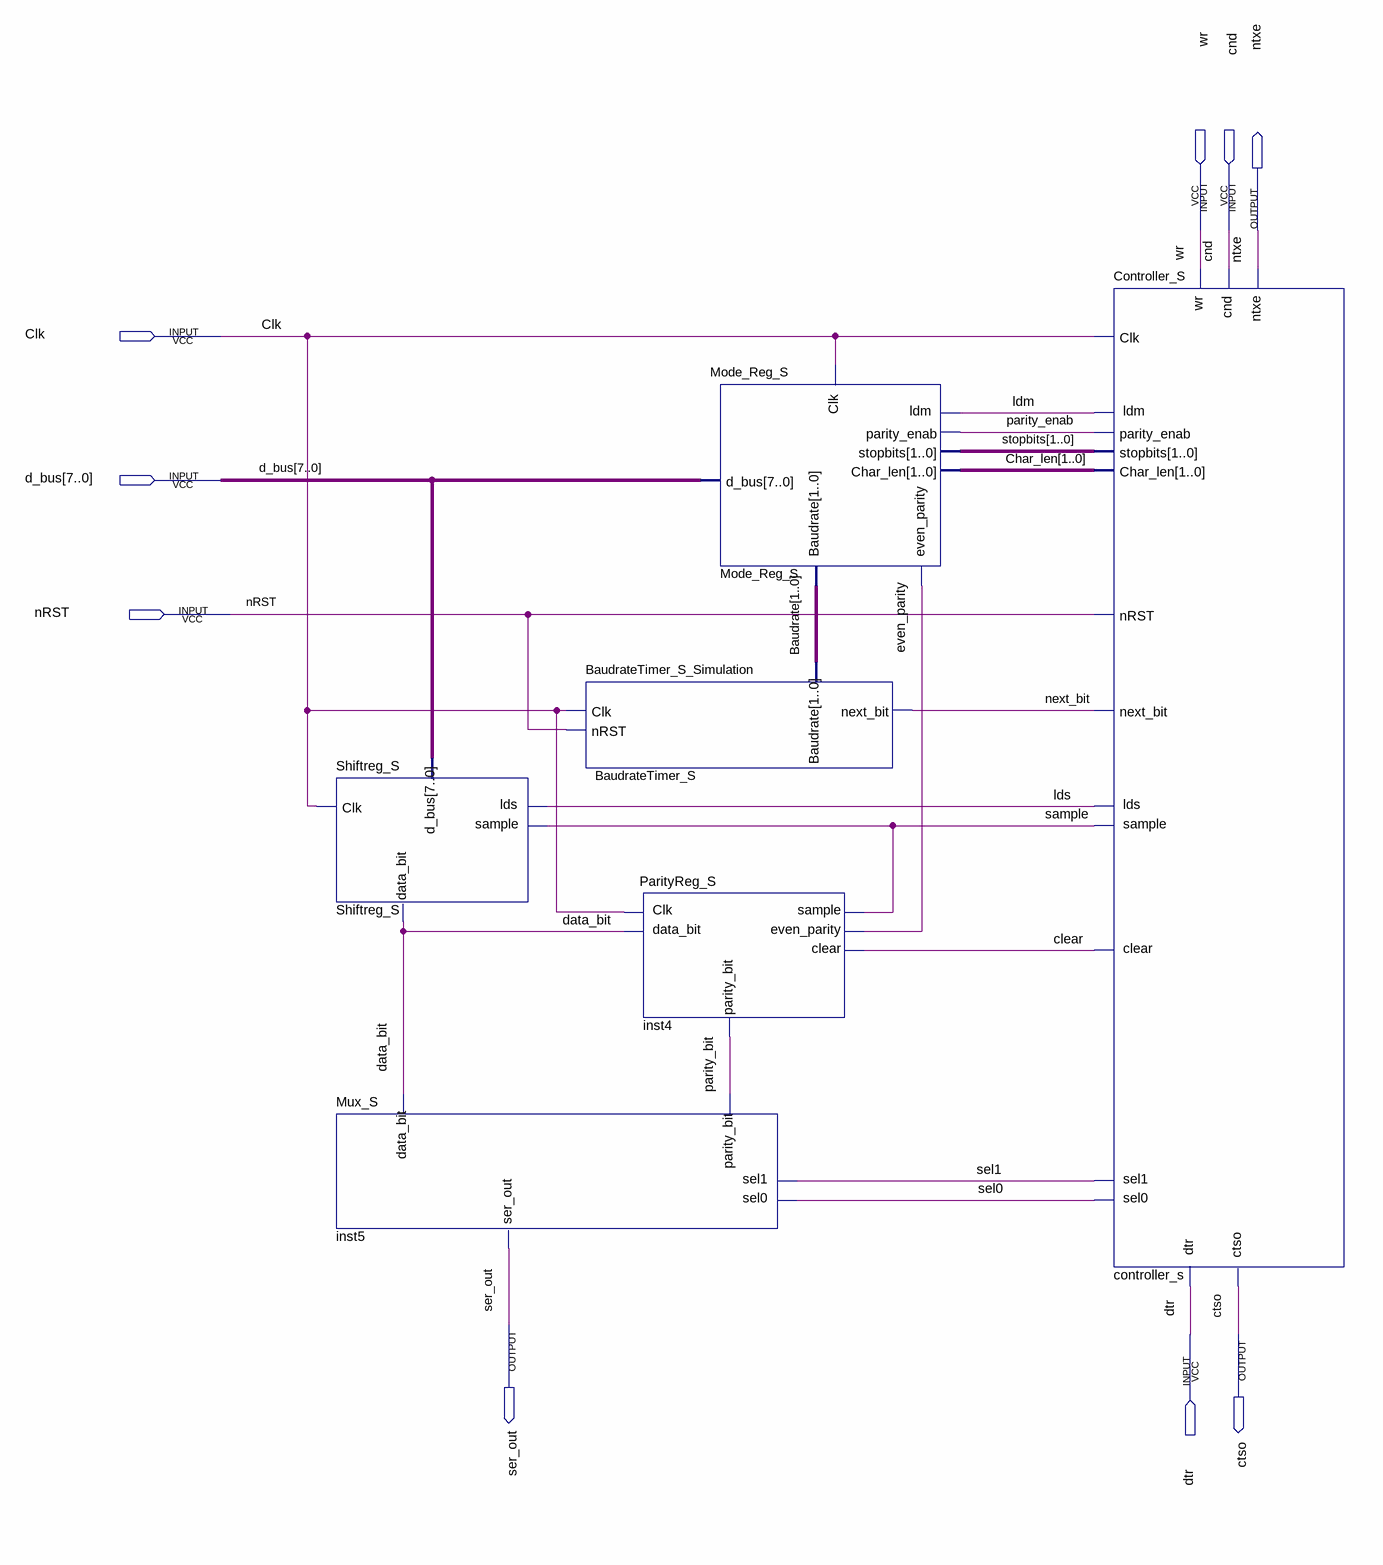
[diagram p0: schematic sheet]
// Quartus schematic Par2Ser_Simulation.bdf as structural Verilog: 6 symbols, 9 pins
module Par2Ser_Simulation (
  input  wr,
  input  cnd,
  input  Clk,
  input  [7:0] d_bus,
  input  nRST,
  input  dtr,
  output ntxe,
  output ser_out,
  output ctso
);

  wire clear, data_bit, even_parity, ldm, lds, next_bit, parity_bit, parity_enab, sample, sel0, sel1;
  wire [1:0] Baudrate, Char_len, stopbits;

  Shiftreg_S Shiftreg_S (.Clk(Clk), .d_bus(d_bus), .lds(lds), .sample(sample), .data_bit(data_bit));
  Mux_S inst5 (.data_bit(data_bit), .parity_bit(parity_bit), .sel0(sel0), .sel1(sel1), .ser_out(ser_out));
  BaudrateTimer_S_Simulation BaudrateTimer_S (.Baudrate(Baudrate), .Clk(Clk), .nRST(nRST), .next_bit(next_bit));
  ParityReg_S inst4 (
    .Clk(Clk), .clear(clear), .data_bit(data_bit), .even_parity(even_parity), .sample(sample),
    .parity_bit(parity_bit));
  Mode_Reg_S Mode_Reg_S (
    .Clk(Clk), .d_bus(d_bus), .ldm(ldm), .Baudrate(Baudrate), .Char_len(Char_len), .even_parity(even_parity),
    .parity_enab(parity_enab), .stopbits(stopbits));
  Controller_S controller_s (
    .Char_len(Char_len), .Clk(Clk), .cnd(cnd), .dtr(dtr), .nRST(nRST), .next_bit(next_bit),
    .parity_enab(parity_enab), .stopbits(stopbits), .wr(wr), .clear(clear), .ctso(ctso), .ldm(ldm),
    .lds(lds), .ntxe(ntxe), .sample(sample), .sel0(sel0), .sel1(sel1));
endmodule
